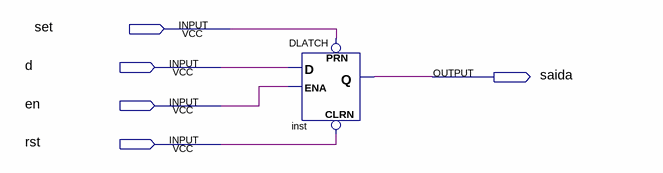
[diagram p0: schematic sheet]
// Quartus schematic Pratica05_Bloco_rpr_latch.bdf as structural Verilog: 1 symbols, 5 pins
module Pratica05_Bloco_rpr_latch (
  input  set,
  input  d,
  input  en,
  input  rst,
  output saida
);

  DLATCH inst (.CLRN(rst), .D(d), .ENA(en), .PRN(set), .Q(saida));
endmodule
